# Altium schematic sheet [5]-MCU_POWER.SchDoc
size A4
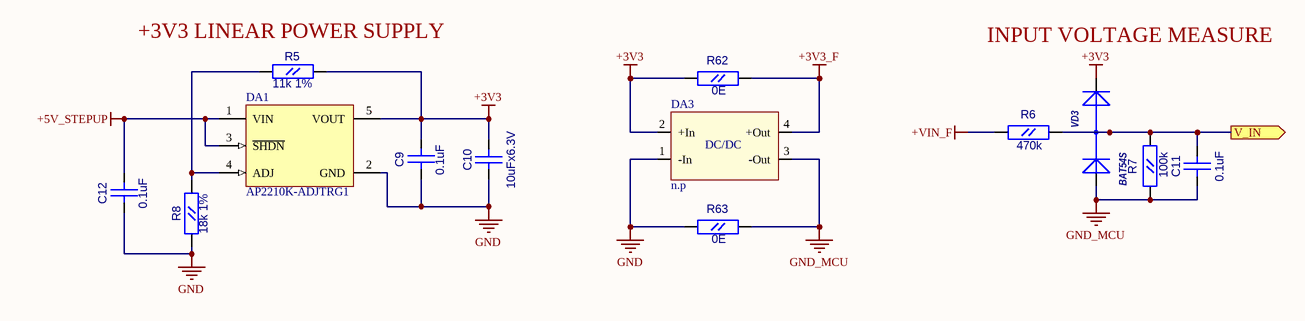
[diagram p0: [5]-MCU_POWER.SchDoc]

## Parts
C9  0.1uF  [CC0603]
C10  10uFx6.3V  [CC0805]
C11  0.1uF  [CC0603]
C12  0.1uF  [CC0603]
DA1  AP2210K-ADJTRG1  [SOT23-5]
DA3  n.p  [CME0303S3C]
R5  11k 1%  [RC0603]
R6  470k  [RC0603]
R7  100k  [RC0603]
R8  18k 1%  [RC0603]
R62  0E  [RC0805]
R63  0E  [RC0805]
VD3  BAT54S  [SOT-23(GSD)]

## Ports
V_IN (out)

## Nets
+3V3: C9.1(A) C10.2(B) DA1.5(VOUT) DA3.2(+In) R5.2(B) R62.1(A) VD3.2(K)
+3V3_F: DA3.4(+Out) R62.2(B)
+5V_STEPUP: C12.1(A) DA1.1(VIN) DA1.3(~{SHDN})
+VIN_F: R6.1(A)
GND: C9.2(B) C10.1(A) C12.2(B) DA1.2(GND) DA3.1(-In) R8.1(A) R63.1(A)
GND_MCU: C11.1(A) DA3.3(-Out) R7.1(A) R63.2(B) VD3.1(A)
V_IN: C11.2(B) R6.2(B) R7.2(B) VD3.3(AK) ; port V_IN
NetDA1_4: DA1.4(ADJ) R5.1(A) R8.2(B)

## Notes on the sheet
- (near R5) +3V3 LINEAR POWER SUPPLY
- (near VD3) INPUT VOLTAGE MEASURE
- (in symbol CME0303S3C) DC/DC

## Library data of the parts
C9 C11 C12 = CC0603: Value: 0.1uF
C10 = CC0805: Value: 10uFx6.3V
DA1 = MCP1824T-ADJE/OT: 300 mA, Low Voltage, Low Quiescent Current LDO Regulator, 5-Pin SOT-223, Extended Temperature, Tape and Reel; Published: 29-Jan-2009; DatasheetVersion: revA, Aug-2007; PackageVersion: revAW, Oct-2008; PackageReference: SOT-223-DC5; Publisher: Altium Limited; PackageDescription: 5-Lead Plastic Small Outline Transistor (DC) [SOT-223]; ComponentLink1Description: Manufacturer Link; ComponentLink1URL: http://www.microchip.com; ComponentLink2Description: Datasheet; ComponentLink2URL: http://ww1.microchip.com/downloads/en/DeviceDoc/22070a.pdf; ComponentLink3Description: Packaging Specification; ComponentLink3URL: http://ww1.microchip.com/downloads/en/PackagingSpec/00049AW.pdf
DA3 = CME0303S3C: DC/DC converter
R5-R8 = RC0603
  R5: Value: 11k 1%
  R6: Value: 470k
  R7: Value: 100k
  R8: Value: 18k 1%
R62 R63 = RC0805: Value: 0E
VD3 = BAT54S: 1.0 Ampere General Purpose Rectifier; ComponentField6: Published 8-Jun-2000, Modified 11-July-2000: SIM Model Added.; Value: *